# EAGLE design 0117-FETz4 (EAGLE 9.6.2)
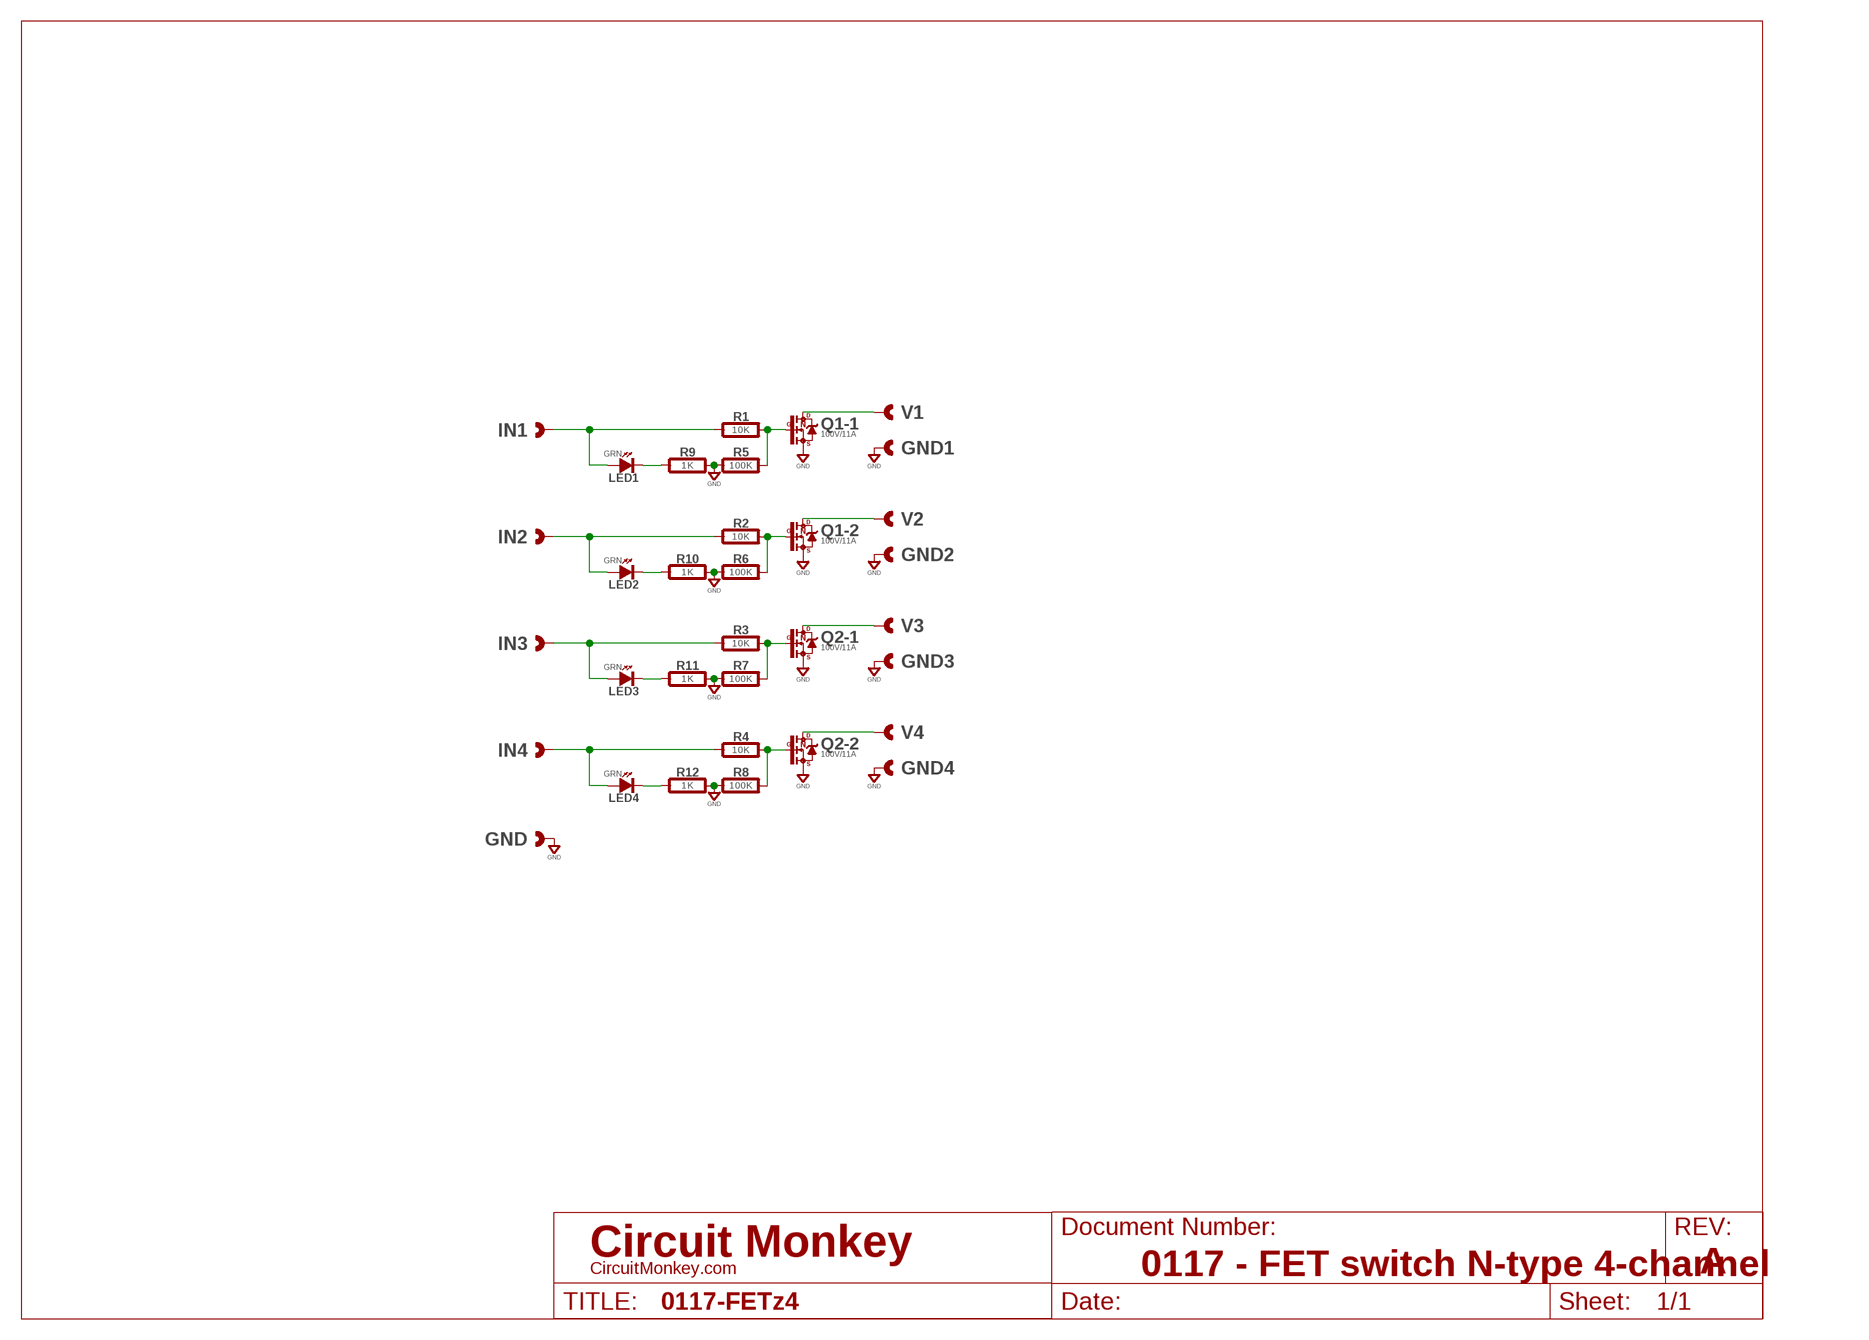
[diagram p0: schematic, sheet 1]
U$1 (LETTER_L-CIRCUITMONKEY): DOCUMENT_NUMBER: 0117 - FET switch N-type 4-channel; REV: A

## Parts
GND  CAST-01X12.00MM  [CAST01-2.00MM]
GND1  CAST-01X12.00MM  [CAST01-2.00MM]
GND2  CAST-01X12.00MM  [CAST01-2.00MM]
GND3  CAST-01X12.00MM  [CAST01-2.00MM]
GND4  CAST-01X12.00MM  [CAST01-2.00MM]
IN1  CAST-01X12.00MM  [CAST01-2.00MM]
IN2  CAST-01X12.00MM  [CAST01-2.00MM]
IN3  CAST-01X12.00MM  [CAST01-2.00MM]
IN4  CAST-01X12.00MM  [CAST01-2.00MM]
LED1  GRN  SMT0603  [SMD_0603]
LED2  GRN  SMT0603  [SMD_0603]
LED3  GRN  SMT0603  [SMD_0603]
LED4  GRN  SMT0603  [SMD_0603]
Q1  100V/11A  N-FET_DUALSQJB68EP  [POWER_PAK-SO-8L-DUAL]
Q2  100V/11A  N-FET_DUALSQJB68EP  [POWER_PAK-SO-8L-DUAL]
R1  10K  RESISTOR0603  [0603-RES]
R2  10K  RESISTOR0603  [0603-RES]
R3  10K  RESISTOR0603  [0603-RES]
R4  10K  RESISTOR0603  [0603-RES]
R5  100K  RESISTOR0603  [0603-RES]
R6  100K  RESISTOR0603  [0603-RES]
R7  100K  RESISTOR0603  [0603-RES]
R8  100K  RESISTOR0603  [0603-RES]
R9  1K  RESISTOR0603  [0603-RES]
R10  1K  RESISTOR0603  [0603-RES]
R11  1K  RESISTOR0603  [0603-RES]
R12  1K  RESISTOR0603  [0603-RES]
V1  CAST-01X12.00MM  [CAST01-2.00MM]
V2  CAST-01X12.00MM  [CAST01-2.00MM]
V3  CAST-01X12.00MM  [CAST01-2.00MM]
V4  CAST-01X12.00MM  [CAST01-2.00MM]

## Nets
GND: GND1.1 GND1.P$1 GND1.P$2 GND2.1 GND2.P$1 GND2.P$2 GND3.1 GND3.P$1 GND3.P$2 GND4.1 GND4.P$1 GND4.P$2 GND.1 GND.P$1 GND.P$2 Q1.S1(-1:S) Q1.S2(-2:S) Q2.S1(-1:S) Q2.S2(-2:S) R5.1 R6.1 R7.1 R8.1 R9.2 R10.2 R11.2 R12.2
N$1: Q1.D1(-1:D) Q1.D1B(-1:D) Q1.D1C(-1:D) V1.1 V1.P$1 V1.P$2
N$2: LED1.K(C) R9.1
N$3: Q1.D2(-2:D) Q1.D2B(-2:D) Q1.D2C(-2:D) V2.1 V2.P$1 V2.P$2
N$5: Q2.D1(-1:D) Q2.D1B(-1:D) Q2.D1C(-1:D) V3.1 V3.P$1 V3.P$2
N$6: LED2.K(C) R10.1
N$7: Q2.D2(-2:D) Q2.D2B(-2:D) Q2.D2C(-2:D) V4.1 V4.P$1 V4.P$2
N$9: IN1.1 IN1.P$1 IN1.P$2 LED1.A R1.1
N$10: IN2.1 IN2.P$1 IN2.P$2 LED2.A R2.1
N$11: IN3.1 IN3.P$1 IN3.P$2 LED3.A R3.1
N$12: IN4.1 IN4.P$1 IN4.P$2 LED4.A R4.1
N$13: Q1.G1(-1:G) R1.2 R5.2
N$14: Q1.G2(-2:G) R2.2 R6.2
N$15: Q2.G1(-1:G) R3.2 R7.2
N$16: Q2.G2(-2:G) R4.2 R8.2
N$17: LED3.K(C) R11.1
N$19: LED4.K(C) R12.1

## Library data of the parts
GND GND1-GND4 IN1-IN4 V1-V4 = con-headers:CAST-01X1: Castelated Edge Hole Pad
LED1-LED4 = led:SMT: LED SMT
Q1 Q2 = transistor-fet:N-FET_DUAL: Dual FET; COST01: 0.92; MFR: Vishay; MPN: SQJB68EP
R1-R12 = rlc:RESISTOR: Resistor

## Board
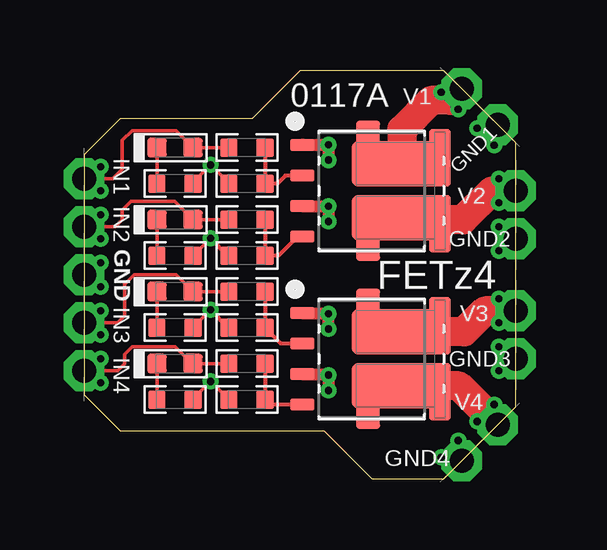
[diagram p1: board, top side]
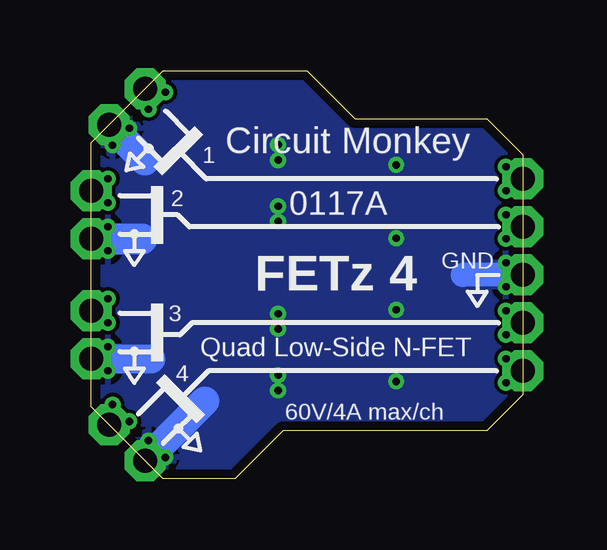
[diagram p2: board, bottom side, seen from below]

Size 18 x 17 mm. Coordinates in mm from the lower left corner, seen from the top.
Outline: 1.5,2 10,2 12,0 15,0 18,3 18,14 15,17 9,17 7,15 1.5,15 0,13.5 0,3.5 1.5,2
Copper layers (1*16): Top 0.0356mm / dielectric 1.5011mm / Bottom 0.0356mm
Design rules "OSH-CircuitMonkey *": minimum track width 6mil, minimum drill 12mil, track to track 6mil, track to pad 6mil, pad to pad 6mil, via to via 6mil, smd to smd 6mil, copper to edge 15mil, drill to drill 6mil, minimum pad ring 7mil, minimum via ring 7mil, stop-mask expansion 3mil, vias tented up to drill 13mil, thermal gap 10mil

### Footprints (pad centres in the part's own frame; a part is rotated, then mirrored left to right if it is on the bottom)
CAST01-2.00MM = drill 1 pad 1.7 octagon: 1 0,0 | drill 0.305: P$1 -0.7,0.5; P$2 -0.7,-0.5
SMD_0603 = smd 0.8 x 0.8: A 0.75,0; K -0.75,0
POWER_PAK-SO-8L-DUAL = smd 0.9 x 2.4: D1 2.85,1.375; D2 2.85,-1.375 | smd 3.81 x 1.9: D1B 1.059,1.125; D2B 1.059,-1.125 | smd 1 x 1.1: D1C -0.15,2.375; D2C -0.15,-2.375 | smd 1 x 0.52: G1 -2.9,0.635; G2 -2.9,-1.905; S1 -2.9,1.905; S2 -2.9,-0.635
0603-RES = smd 0.711 x 0.762: 1 -0.752,0; 2 0.752,0

### Placement (x,y rotation side)
GND  0,8.5 180 top
GND1  17.25,14.75 45 top
GND2  18,10 0 top
GND3  18,5 0 top
GND4  15.75,0.75 315 top
IN1  0,12.5 180 top
IN2  0,10.5 180 top
IN3  0,6.5 180 top
IN4  0,4.5 180 top
LED1  3.8,13.8 0 top
LED2  3.8,10.8 0 top
LED3  3.8,7.8 0 top
LED4  3.8,4.8 0 top
Q1  12,12 0 top
Q2  12,5 0 top
R1  6.8,13.8 0 top
R2  6.8,10.8 0 top
R3  6.8,7.8 0 top
R4  6.8,4.8 0 top
R5  6.8,12.3 0 top
R6  6.8,9.3 0 top
R7  6.8,6.3 0 top
R8  6.8,3.3 0 top
R9  3.8,12.3 0 top
R10  3.8,9.3 0 top
R11  3.8,6.3 0 top
R12  3.8,3.3 0 top
V1  15.75,16.25 45 top
V2  18,12 0 top
V3  18,7 0 top
V4  17.25,2.25 315 top

### Tracks (layer width: path | path; a pad name or v marks a point on that pad's centre or on a via)
GND  (via drill 0.3)
  Top 0.152: 17.25,14.55 GND1.P$1 | GND1.1 17.25,14.55 | 17.25,14.55 GND1.P$2 | 17.8,10 GND2.P$1 | GND2.1 17.8,10 | 17.8,10 GND2.P$2 | 17.8,5 GND3.P$1 | GND3.1 17.8,5 | 17.8,5 GND3.P$2 | 15.61,0.89 GND4.1 15.61,0.89 | 15.61,0.89 GND4.P$1 | 15.61,0.89 GND4.P$2 | R10.2 v5.28,10.02 | R9.2 4.55,12.35 v5.28,13.08 6.05,12.31 R5.1 | R11.2 4.55,6.31 v5.28,7.04 | R12.2 4.55,3.33 v5.28,4.06 v5.29,4.06 R8.1
  Top 0.16: R6.1 6,9.3 v5.28,10.02 | R7.1 6.02,6.3 v5.28,7.04
  Top 0.5: Q2.S1 10.18,6.91 v10.2,6.88 v10.2,6.24 | Q2.S2 10.15,4.37 v10.2,4.32 v10.2,3.68 | Q1.S1 9.12,13.92 v10.2,13.92 v10.2,13.28 | Q1.S2 v10.2,11.36 v10.2,10.72
  Bottom 0.152: 0.2,8.5 GND.P$2 | GND.1 0.2,8.5 | 0.2,8.5 GND.P$1
  Bottom 1: GND.1 2.5,8.5
  Bottom 1.2: GND4.1 13.25,3.25 | GND3.1 15.5,5 | GND1.1 15.75,13.25
  Bottom 1.3: GND2.1 15.88,10
  pour Bottom (rank 5): 10,2 1.5,2 0,3.5 0,13.5 1.5,15 7,15 9,17 15,17 18,14 18,3 15,0 12,0
N$1
  Top 0.152: V1.P$1 15.75,16.05 V1.1 15.75,15.54 V1.P$2 | Q1.D1C 13.1,13.12 13.25,13.12
  Top 0.5: Q1.D1 14.6,13.12 13.25,13.12 12.74,13.12
  Top 1.2: 12.74,13.12 Q1.D1B | V1.1 15.27,15.77 14.47,15.77 13.25,14.55 13.25,13.12
N$2
  Top 0.152: LED1.K R9.1
N$3
  Top 0.152: 17.8,12 V2.P$1 | V2.1 17.8,12 | 17.8,12 V2.P$2 | 11.96,10.88 Q1.D2B 13.13,10.95 13.15,10.95
  Top 0.5: Q1.D2 14.53,10.95 13.15,10.95 | Q1.D2C 11.85,10.77 11.96,10.88
  Top 1.2: V2.1 17.02,12 15.81,10.79 15.01,10.79 Q1.D2
N$5
  Top 0.152: 17.8,7 V3.P$1 | V3.1 17.8,7 | 17.8,7 V3.P$2 | Q2.D1C 13.06,6.17 Q2.D1B
  Top 0.5: Q2.D1 14.6,6.12 Q2.D1B
  Top 1.2: V3.1 16.72,7 15.85,6.12 Q2.D1B
N$6
  Top 0.152: LED2.K R10.1
N$7
  Top 0.152: 17.11,2.39 V4.1 17.11,2.39 | 17.11,2.39 V4.P$1 | 17.11,2.39 V4.P$2 | Q2.D2C 11.85,2.81 12.92,3.88
  Top 0.5: Q2.D2 14.6,3.88 13.53,3.88 12.92,3.88
  Top 1.2: Q2.D2B 13.53,3.88 15.62,3.88 V4.1
N$9
  Top 0.152: R1.1 LED1.A 3.85,14.5 2,14.5 1.6,14.1 1.6,12.9 1.2,12.5 IN1.1
  Top 0.16: 0.2,12.5 IN1.P$1 | IN1.1 0.2,12.5 | 0.2,12.5 IN1.P$2
N$10
  Top 0.152: R2.1 LED2.A 3.79,11.56 1.96,11.56 1.6,11.2 1.6,10.8 1.3,10.5 IN2.1
  Top 0.16: 0.2,10.5 IN2.P$2 | IN2.1 0.2,10.5 | 0.2,10.5 IN2.P$1
N$11
  Top 0.152: 0.2,6.5 IN3.P$1 | 0.2,6.5 IN3.1 1.4,6.5 1.7,6.8 1.7,8.1 2.1,8.5 3.85,8.5 LED3.A R3.1 | 0.2,6.5 IN3.P$2
  Top 0.16: 0.15,6.5 IN3.1
N$12
  Top 0.152: 0.2,4.5 IN4.P$1 | 0.2,4.5 IN4.1 1.4,4.5 1.7,4.8 1.7,5.2 2,5.5 3.8,5.5 4.5,4.8 LED4.A R4.1 | 0.2,4.5 IN4.P$2
N$13
  Top 0.16: Q1.G1 8.4,12.63 8.06,12.3 R5.2 R1.2
N$14
  Top 0.16: Q1.G2 8.9,10.1 8.11,9.3 R6.2 R2.2
N$15
  Top 0.16: Q2.G1 8.22,5.63 R7.2 R3.2
N$16
  Top 0.16: Q2.G2 7.76,3.1 R8.2 R4.2
N$17
  Top 0.152: LED3.K R11.1
N$19
  Top 0.152: R12.1 LED4.K

### Text on the board
tPlace: 0117A | FETz4
bPlace: Circuit Monkey | 1 | 0117A | 2 | GND | FETz 4 | 3 | Quad Low-Side N-FET | 4 | 60V/4A max/ch